# Altium project interposer-breakout.PrjPcb
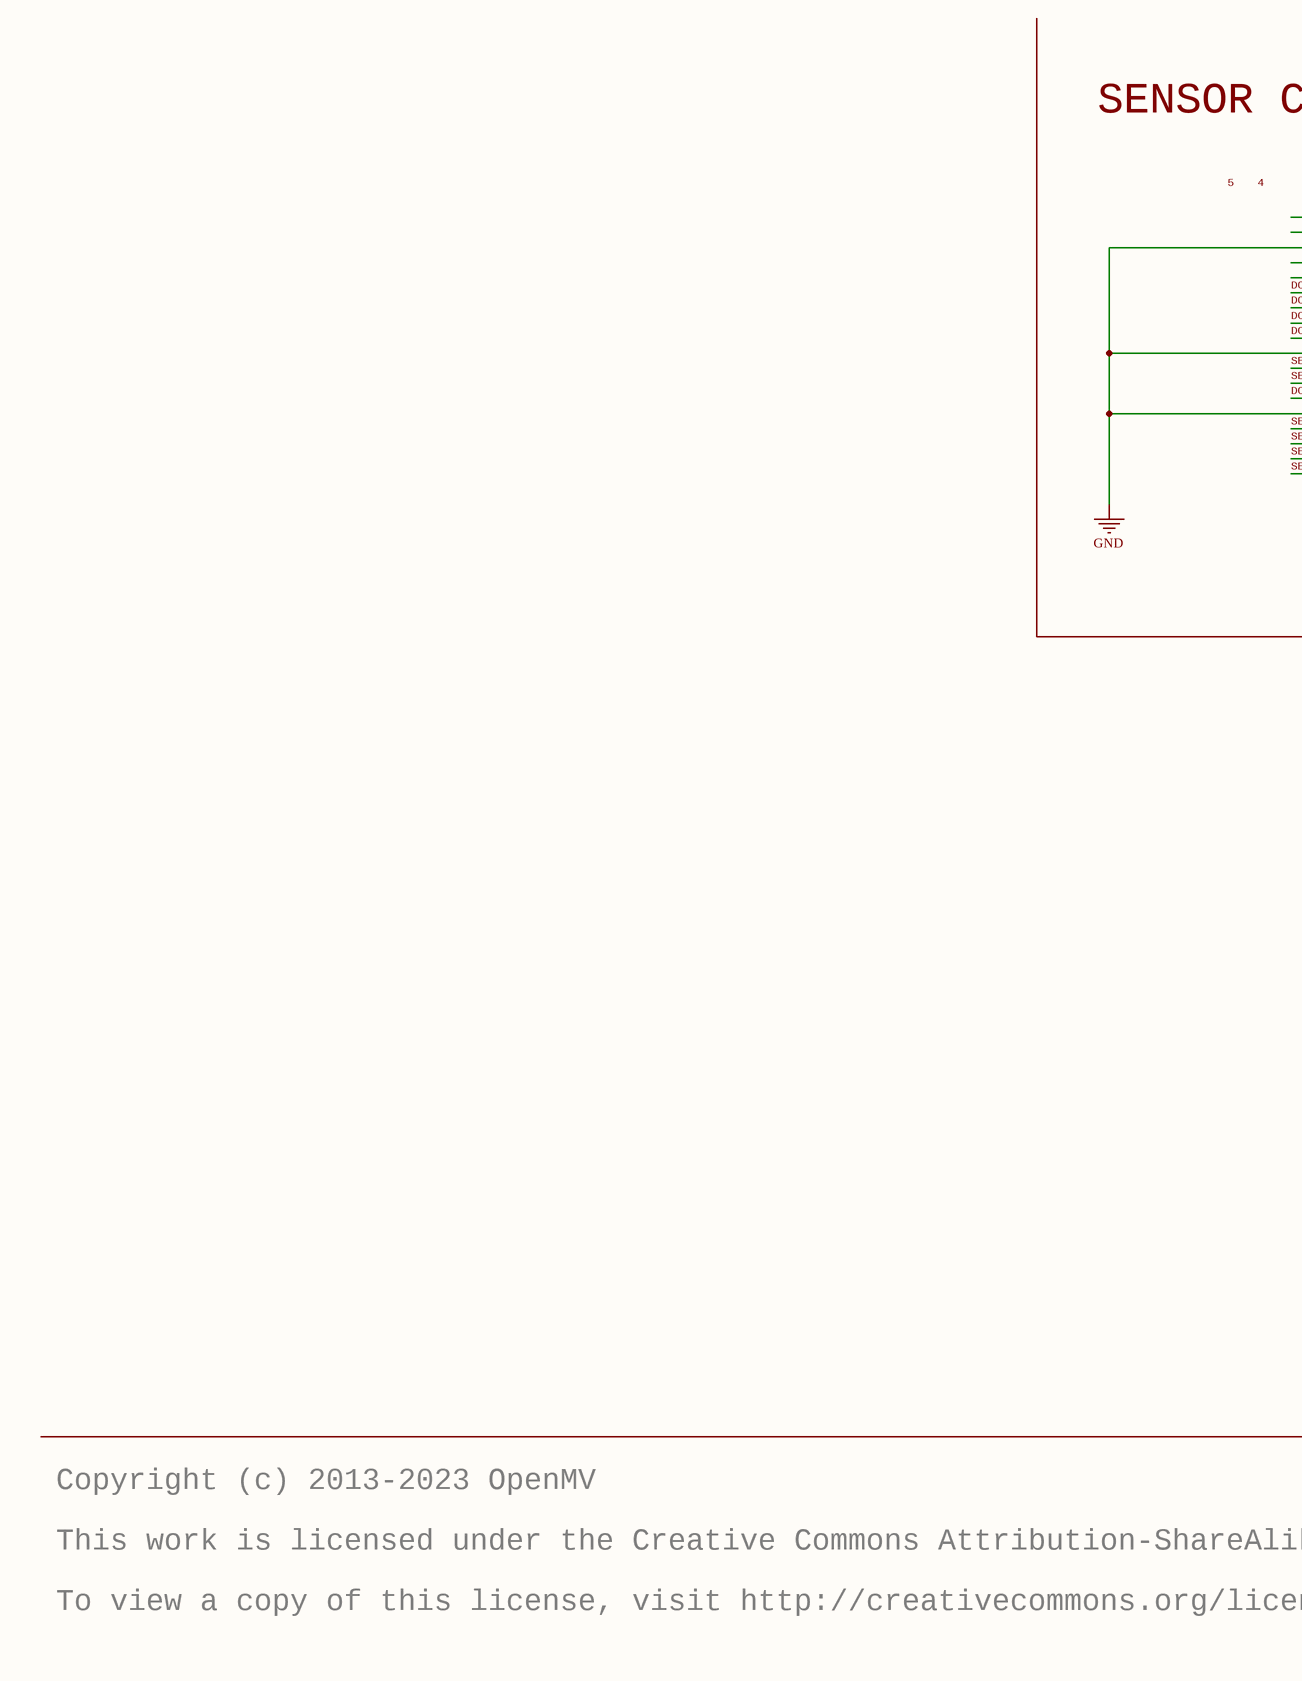
[diagram p0: interposer-breakout.SchDoc, left]
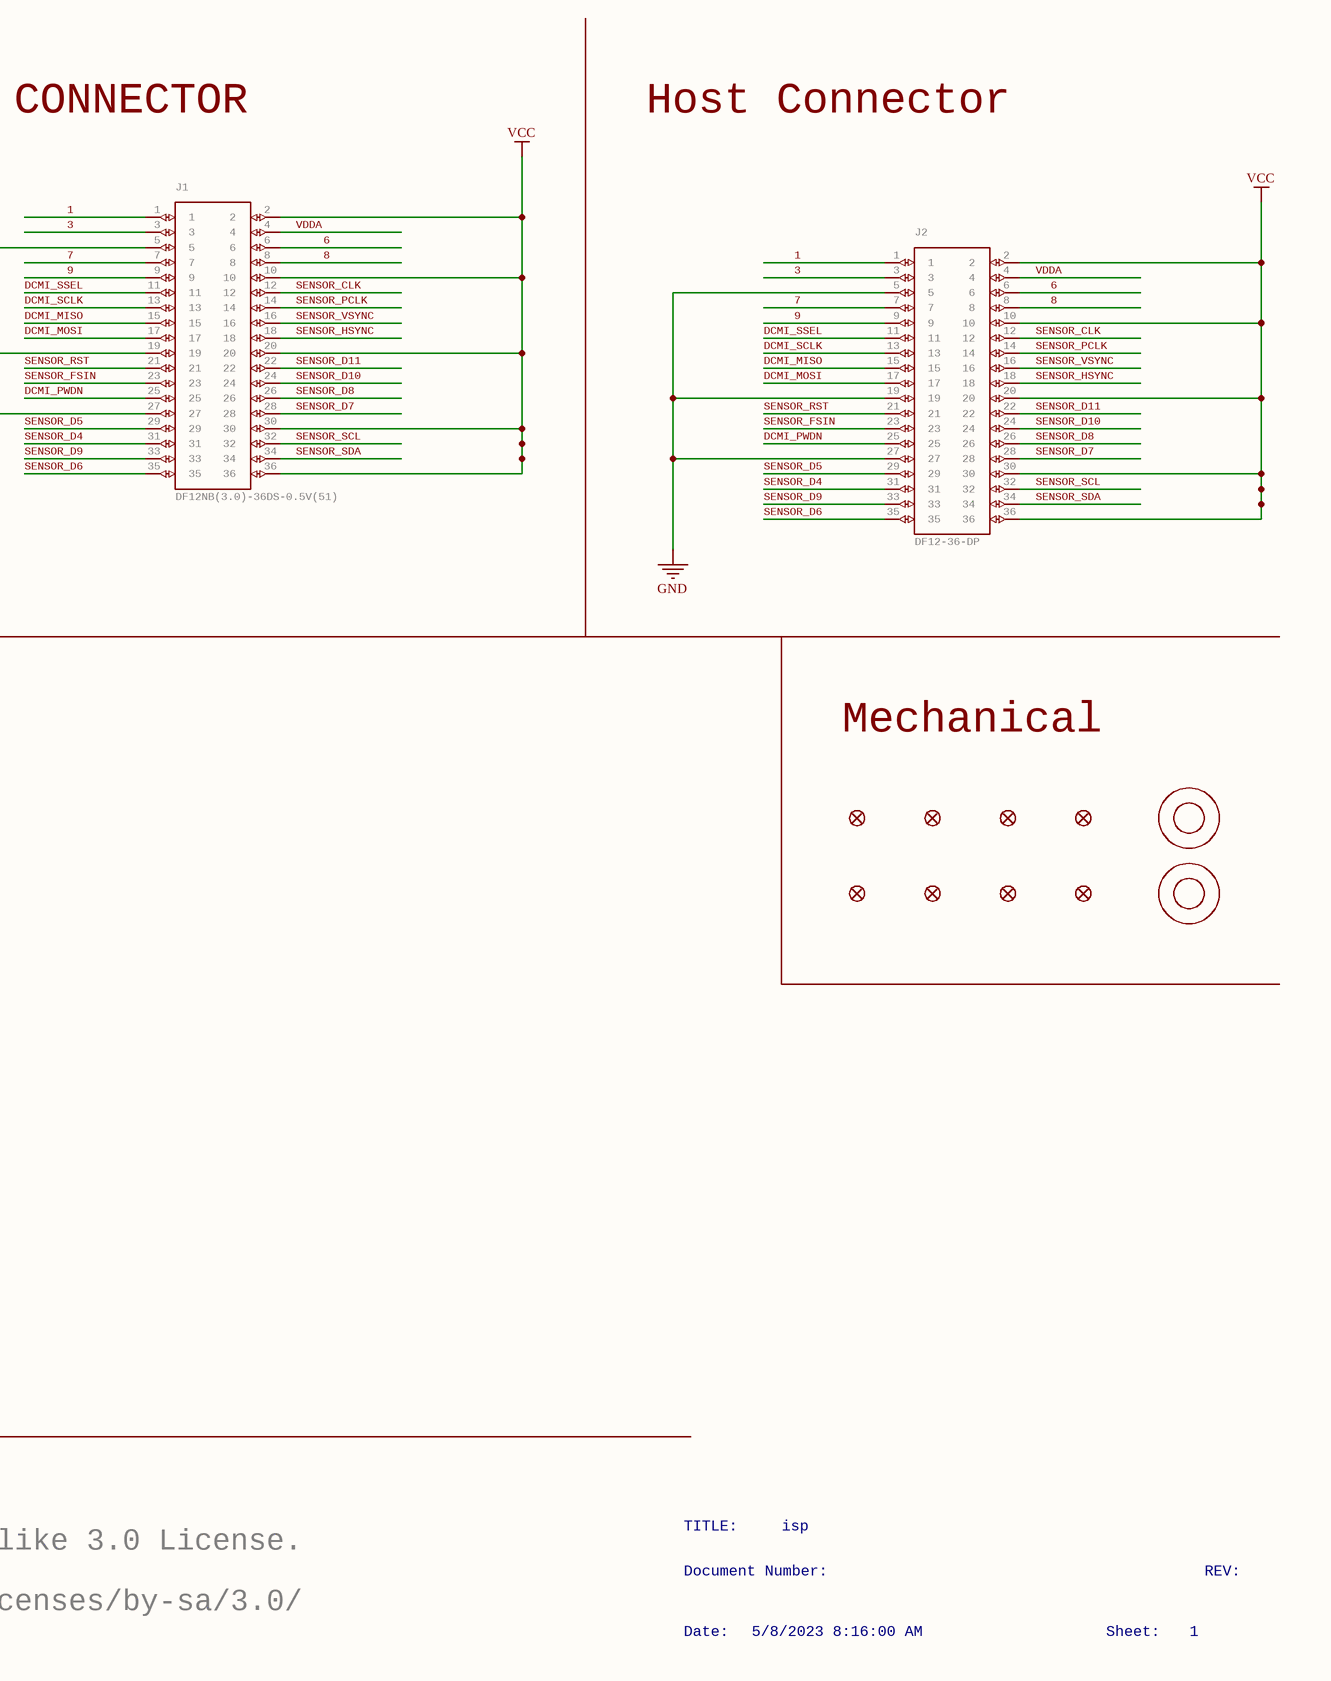
[diagram p1: interposer-breakout.SchDoc, right]
1 sheet, 12 parts. Net scope: global (net labels, ports and power ports of the same name join across sheets).
Board file: interposer-breakout.PcbDoc

## Sheet interposer-breakout.SchDoc: isp
size 453 x 317 mm; Origin: Eagle; Date: 5/8/2023 8:16:00 AM; SheetNumber: 1; GateName_1: G$1; SymbolName_1: FRAME_B_L; LibraryName: frames; DeviceSetName: FRAME_B_L; GateName_2: G$2; SymbolName_2: DOCFIELD; Sheet: Sheet:; REV: REV:

### Parts
FD1  FIDUCIAL1X2  [FIDUCIAL-1X2]  (value not drawn)
FD2  FIDUCIAL1X2  [FIDUCIAL-1X2]  (value not drawn)
FD3  FIDUCIAL1X2  [FIDUCIAL-1X2]  (value not drawn)
FD4  FIDUCIAL1X2  [FIDUCIAL-1X2]  (value not drawn)
FD5  FIDUCIAL1X2  [FIDUCIAL-1X2]  (value not drawn)
FD6  FIDUCIAL1X2  [FIDUCIAL-1X2]  (value not drawn)
FD7  FIDUCIAL1X2  [FIDUCIAL-1X2]  (value not drawn)
FD8  FIDUCIAL1X2  [FIDUCIAL-1X2]  (value not drawn)
J1  DF12NB(3.0)-36DS-0.5V(51)  [DF12-36-DS]
J2  DF12-36-DP  [DF12-36-DP]
M1  9774030151R  [9774030243R]  (value not drawn)
M2  9774030151R  [9774030243R]  (value not drawn)

### Nets
GND: J1.5 J1.19 J1.27 J2.5 J2.19 J2.27
VCC: J1.2 J1.10 J1.20 J1.30 J1.36 J2.2 J2.10 J2.20 J2.30 J2.36
1: J1.1 J2.1
3: J1.3 J2.3
6: J1.6 J2.6
7: J1.7 J2.7
8: J1.8 J2.8
9: J1.9 J2.9
DCMI_MISO: J1.15 J2.15
DCMI_MOSI: J1.17 J2.17
DCMI_PWDN: J1.25 J2.25
DCMI_SCLK: J1.13 J2.13
DCMI_SSEL: J1.11 J2.11
SENSOR_CLK: J1.12 J2.12
SENSOR_D4: J1.31 J2.31
SENSOR_D5: J1.29 J2.29
SENSOR_D6: J1.35 J2.35
SENSOR_D7: J1.28 J2.28
SENSOR_D8: J1.26 J2.26
SENSOR_D9: J1.33 J2.33
SENSOR_D10: J1.24 J2.24
SENSOR_D11: J1.22 J2.22
SENSOR_FSIN: J1.23 J2.23
SENSOR_HSYNC: J1.18 J2.18
SENSOR_PCLK: J1.14 J2.14
SENSOR_RST: J1.21 J2.21
SENSOR_SCL: J1.32 J2.32
SENSOR_SDA: J1.34 J2.34
SENSOR_VSYNC: J1.16 J2.16
VDDA: J1.4 J2.4

### Notes on the sheet
- SENSOR CONNECTOR
- Host Connector
- Mechanical
- Copyright (c) 2013-2023 OpenMV
- TITLE:
- isp
- This work is licensed under the Creative Commons Attribution-ShareAlike 3.0 License.
- To view a copy of this license, visit http://creativecommons.org/licenses/by-sa/3.0/
- Document Number:
- REV:
- Date:
- 5/8/2023 8:16:00 AM
- Sheet:
- 1
- Labels drawn without touching a wire or pin: 4, 5

### Library data of the parts
FD1-FD8 = FIDUCIAL1X2: Fiducial Alignment Points    Point-of-reference for pick-and-place machines and other optical instruments.; GateName_1: G$1; DeviceName: 1X2; SymbolName_1: FIDUCIAL; LibraryName: SparkFun-Aesthetics; DeviceSetName: FIDUCIAL
J1 = DF12-36-DS: GateName_1: G$1; SymbolName_1: DF12-36; LibraryName: DF12-36-DS; DeviceSetName: DF12-36-DS; MPN: DF12NB(3.0)-36DS-0.5V(51)
J2 = DF12-36-DP: MPN: DF12NB(3.0)-36DP-0.5V(51); GateName_1: G$1; SymbolName_1: DF12-36; LibraryName: DF12NB(3.0)-36DP-0.5V(51); DeviceSetName: DF12-36-DP
M1 M2 = 9774030151R: GateName_1: G$1; SymbolName_1: 9774030151R; LibraryName: 9774030151R; DeviceSetName: 9774030151R; MPN: 9774030151R